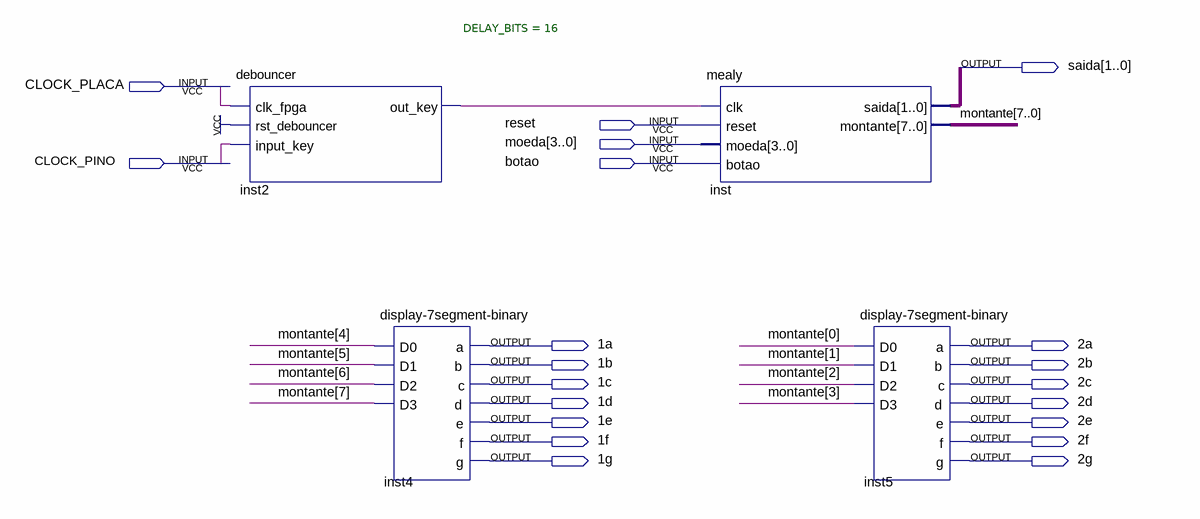
[diagram p0: schematic sheet]
// Quartus schematic MaquinaRefri.bdf as structural Verilog: 4 symbols, 20 pins
module MaquinaRefri (
  input  CLOCK_PLACA,
  input  reset,
  input  [3:0] moeda,
  input  CLOCK_PINO,
  input  botao,
  output [1:0] saida,
  output \1a ,
  output \2a ,
  output \1b ,
  output \2b ,
  output \1c ,
  output \2c ,
  output \1d ,
  output \2d ,
  output \1e ,
  output \2e ,
  output \1f ,
  output \2f ,
  output \1g ,
  output \2g 
);

  wire inst2_out_key;
  wire [7:0] montante;

  debouncer #(.DELAY_BITS(16)) inst2 (
    .clk_fpga(CLOCK_PLACA), .rst_debouncer(1'b1), .input_key(CLOCK_PINO), .out_key(inst2_out_key));
  \display-7segment-binary  inst4 (
    .D0(montante[4]), .D1(montante[5]), .D2(montante[6]), .D3(montante[7]), .a(\1a ), .b(\1b ), .c(\1c ),
    .d(\1d ), .e(\1e ), .f(\1f ), .g(\1g ));
  mealy inst (.clk(inst2_out_key), .reset(reset), .moeda(moeda), .botao(botao), .saida(saida), .montante(montante));
  \display-7segment-binary  inst5 (
    .D0(montante[0]), .D1(montante[1]), .D2(montante[2]), .D3(montante[3]), .a(\2a ), .b(\2b ), .c(\2c ),
    .d(\2d ), .e(\2e ), .f(\2f ), .g(\2g ));
endmodule
